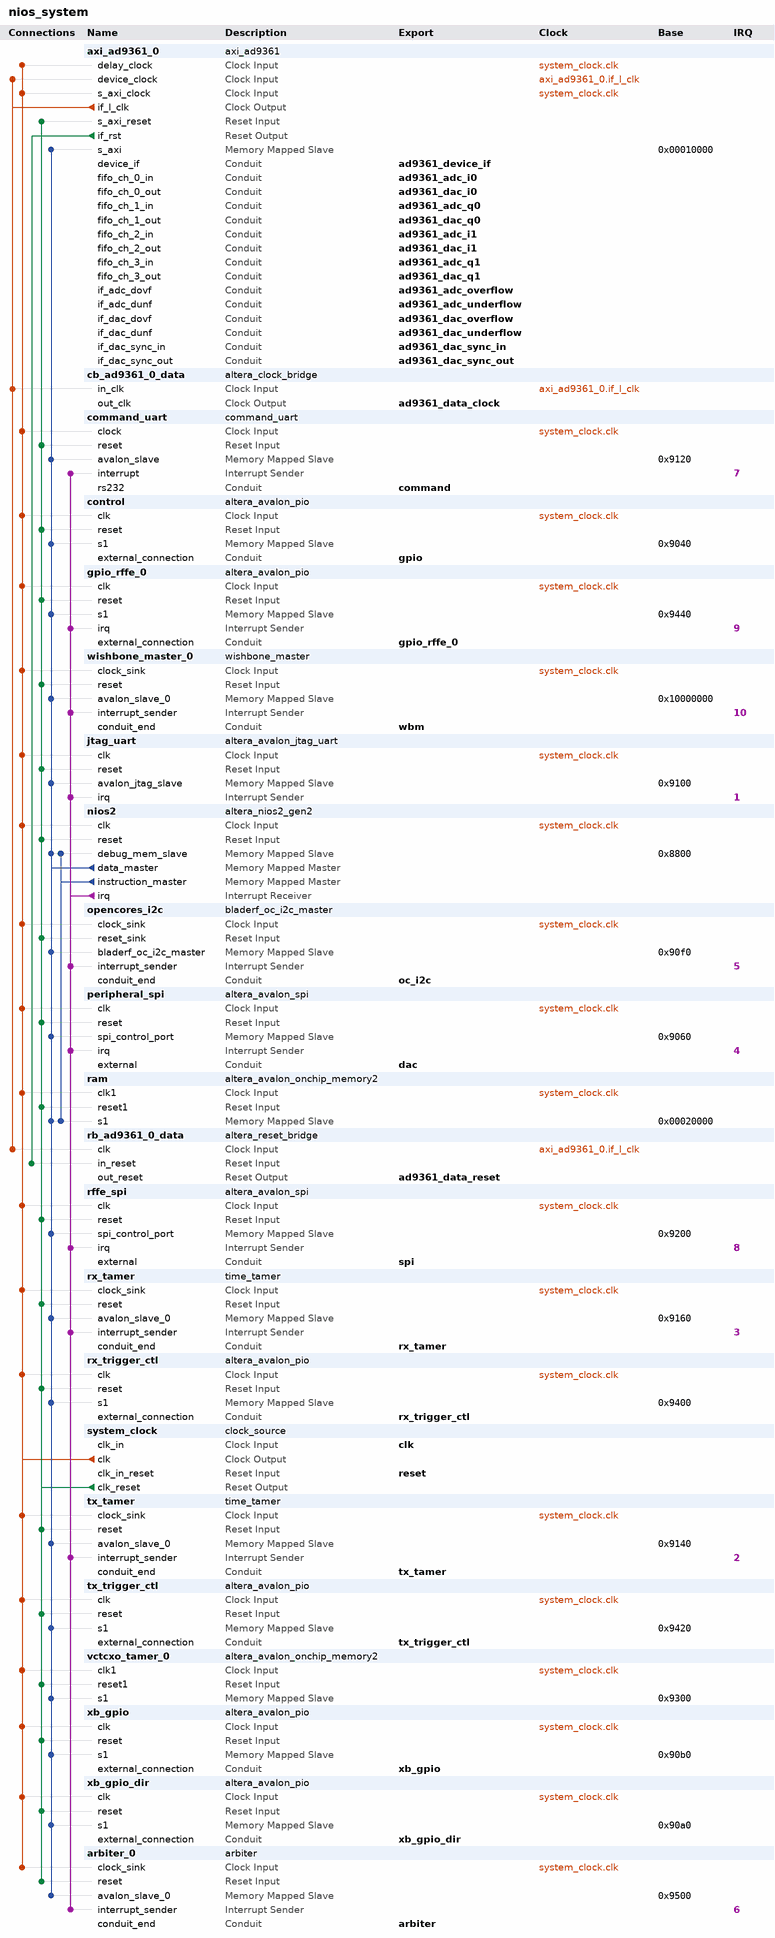
[diagram p0: system contents]
# Platform Designer (Qsys) system nios_system, Cyclone V 5CEBA9F23C8
# Parameters at their usual value, and those the tool derives, are not listed.
package require -exact qsys 17.1
create_system nios_system
set_project_property DEVICE_FAMILY {Cyclone V}
set_project_property DEVICE 5CEBA9F23C8

add_instance axi_ad9361_0 axi_ad9361 1.0
set_instance_parameter_value axi_ad9361_0 DAC_DDS_DISABLE 1
set_instance_parameter_value axi_ad9361_0 DEVICE_TYPE 0
set_instance_parameter_value axi_ad9361_0 ID 0

add_instance cb_ad9361_0_data altera_clock_bridge 17.1
set_instance_parameter_value cb_ad9361_0_data DERIVED_CLOCK_RATE 0
set_instance_parameter_value cb_ad9361_0_data EXPLICIT_CLOCK_RATE 0

add_instance command_uart command_uart 1.0

add_instance control altera_avalon_pio 17.1
set_instance_parameter_value control bitModifyingOutReg true
set_instance_parameter_value control direction InOut
set_instance_parameter_value control width 32

add_instance gpio_rffe_0 altera_avalon_pio 17.1
set_instance_parameter_value gpio_rffe_0 bitModifyingOutReg true
set_instance_parameter_value gpio_rffe_0 direction InOut
set_instance_parameter_value gpio_rffe_0 generateIRQ true
set_instance_parameter_value gpio_rffe_0 resetValue 98304
set_instance_parameter_value gpio_rffe_0 width 32

add_instance wishbone_master_0 wishbone_master 1.0
set_instance_parameter_value wishbone_master_0 ADDR_BITS 32
set_instance_parameter_value wishbone_master_0 DATA_BITS 32

add_instance jtag_uart altera_avalon_jtag_uart 17.1
set_instance_parameter_value jtag_uart simInteractiveOptions INTERACTIVE_INPUT_OUTPUT

add_instance nios2 altera_nios2_gen2 17.1
set_instance_parameter_value nios2 dcache_size 2048
set_instance_parameter_value nios2 dividerType srt2
set_instance_parameter_value nios2 exceptionSlave ram.s1
set_instance_parameter_value nios2 icache_size 2048
set_instance_parameter_value nios2 impl Tiny
set_instance_parameter_value nios2 mul_64_impl 1
set_instance_parameter_value nios2 mul_shift_choice 1
set_instance_parameter_value nios2 resetSlave ram.s1
set_instance_parameter_value nios2 setting_activateTrace true

add_instance opencores_i2c bladerf_oc_i2c_master 1.0
set_instance_parameter_value opencores_i2c ARST_LVL 1

add_instance peripheral_spi altera_avalon_spi 17.1
set_instance_parameter_value peripheral_spi clockPhase 1
set_instance_parameter_value peripheral_spi clockPolarity 1
set_instance_parameter_value peripheral_spi dataWidth 8
set_instance_parameter_value peripheral_spi masterSPI true
set_instance_parameter_value peripheral_spi numberOfSlaves 2
set_instance_parameter_value peripheral_spi targetClockRate 9600000

add_instance ram altera_avalon_onchip_memory2 17.1
set_instance_parameter_value ram allowInSystemMemoryContentEditor true
set_instance_parameter_value ram dataWidth 32
set_instance_parameter_value ram dualPort false
set_instance_parameter_value ram initMemContent true
set_instance_parameter_value ram initializationFileName onchip_memory2_0
set_instance_parameter_value ram instanceID MED
set_instance_parameter_value ram memorySize 131072

add_instance rb_ad9361_0_data altera_reset_bridge 17.1
set_instance_parameter_value rb_ad9361_0_data ACTIVE_LOW_RESET 0
set_instance_parameter_value rb_ad9361_0_data SYNCHRONOUS_EDGES deassert

add_instance rffe_spi altera_avalon_spi 17.1
set_instance_parameter_value rffe_spi clockPolarity 1
set_instance_parameter_value rffe_spi dataWidth 8
set_instance_parameter_value rffe_spi masterSPI true
set_instance_parameter_value rffe_spi numberOfSlaves 1
set_instance_parameter_value rffe_spi targetClockRate 40000000

add_instance rx_tamer time_tamer 1.0

add_instance rx_trigger_ctl altera_avalon_pio 17.1
set_instance_parameter_value rx_trigger_ctl bitModifyingOutReg true
set_instance_parameter_value rx_trigger_ctl direction InOut
set_instance_parameter_value rx_trigger_ctl width 8

add_instance system_clock clock_source 17.1
set_instance_parameter_value system_clock clockFrequency 80000000
set_instance_parameter_value system_clock resetSynchronousEdges DEASSERT

add_instance tx_tamer time_tamer 1.0

add_instance tx_trigger_ctl altera_avalon_pio 17.1
set_instance_parameter_value tx_trigger_ctl bitModifyingOutReg true
set_instance_parameter_value tx_trigger_ctl direction InOut
set_instance_parameter_value tx_trigger_ctl width 8

add_instance vctcxo_tamer_0 altera_avalon_onchip_memory2 17.1
set_instance_parameter_value vctcxo_tamer_0 dataWidth 8
set_instance_parameter_value vctcxo_tamer_0 dualPort false
set_instance_parameter_value vctcxo_tamer_0 initMemContent false
set_instance_parameter_value vctcxo_tamer_0 initializationFileName onchip_mem.hex
set_instance_parameter_value vctcxo_tamer_0 memorySize 256

add_instance xb_gpio altera_avalon_pio 17.1
set_instance_parameter_value xb_gpio direction InOut
set_instance_parameter_value xb_gpio width 32

add_instance xb_gpio_dir altera_avalon_pio 17.1
set_instance_parameter_value xb_gpio_dir direction Output
set_instance_parameter_value xb_gpio_dir width 32

add_instance arbiter_0 arbiter 1.0
set_instance_parameter_value arbiter_0 N 2

# connections
add_connection axi_ad9361_0.if_l_clk axi_ad9361_0.device_clock clock
add_connection axi_ad9361_0.if_l_clk cb_ad9361_0_data.in_clk clock
add_connection axi_ad9361_0.if_l_clk rb_ad9361_0_data.clk clock
add_connection system_clock.clk arbiter_0.clock_sink clock
add_connection system_clock.clk axi_ad9361_0.delay_clock clock
add_connection system_clock.clk axi_ad9361_0.s_axi_clock clock
add_connection system_clock.clk command_uart.clock clock
add_connection system_clock.clk control.clk clock
add_connection system_clock.clk gpio_rffe_0.clk clock
add_connection system_clock.clk jtag_uart.clk clock
add_connection system_clock.clk nios2.clk clock
add_connection system_clock.clk opencores_i2c.clock_sink clock
add_connection system_clock.clk peripheral_spi.clk clock
add_connection system_clock.clk ram.clk1 clock
add_connection system_clock.clk rffe_spi.clk clock
add_connection system_clock.clk rx_tamer.clock_sink clock
add_connection system_clock.clk rx_trigger_ctl.clk clock
add_connection system_clock.clk tx_tamer.clock_sink clock
add_connection system_clock.clk tx_trigger_ctl.clk clock
add_connection system_clock.clk vctcxo_tamer_0.clk1 clock
add_connection system_clock.clk wishbone_master_0.clock_sink clock
add_connection system_clock.clk xb_gpio.clk clock
add_connection system_clock.clk xb_gpio_dir.clk clock
add_connection axi_ad9361_0.if_rst rb_ad9361_0_data.in_reset reset
add_connection system_clock.clk_reset arbiter_0.reset reset
add_connection system_clock.clk_reset axi_ad9361_0.s_axi_reset reset
add_connection system_clock.clk_reset command_uart.reset reset
add_connection system_clock.clk_reset control.reset reset
add_connection system_clock.clk_reset gpio_rffe_0.reset reset
add_connection system_clock.clk_reset jtag_uart.reset reset
add_connection system_clock.clk_reset nios2.reset reset
add_connection system_clock.clk_reset opencores_i2c.reset_sink reset
add_connection system_clock.clk_reset peripheral_spi.reset reset
add_connection system_clock.clk_reset ram.reset1 reset
add_connection system_clock.clk_reset rffe_spi.reset reset
add_connection system_clock.clk_reset rx_tamer.reset reset
add_connection system_clock.clk_reset rx_trigger_ctl.reset reset
add_connection system_clock.clk_reset tx_tamer.reset reset
add_connection system_clock.clk_reset tx_trigger_ctl.reset reset
add_connection system_clock.clk_reset vctcxo_tamer_0.reset1 reset
add_connection system_clock.clk_reset wishbone_master_0.reset reset
add_connection system_clock.clk_reset xb_gpio.reset reset
add_connection system_clock.clk_reset xb_gpio_dir.reset reset
add_connection nios2.data_master arbiter_0.avalon_slave_0 avalon
set_connection_parameter_value nios2.data_master/arbiter_0.avalon_slave_0 baseAddress 0x9500
add_connection nios2.data_master axi_ad9361_0.s_axi avalon
set_connection_parameter_value nios2.data_master/axi_ad9361_0.s_axi baseAddress 0x00010000
add_connection nios2.data_master command_uart.avalon_slave avalon
set_connection_parameter_value nios2.data_master/command_uart.avalon_slave baseAddress 0x9120
add_connection nios2.data_master control.s1 avalon
set_connection_parameter_value nios2.data_master/control.s1 baseAddress 0x9040
add_connection nios2.data_master gpio_rffe_0.s1 avalon
set_connection_parameter_value nios2.data_master/gpio_rffe_0.s1 baseAddress 0x9440
add_connection nios2.data_master jtag_uart.avalon_jtag_slave avalon
set_connection_parameter_value nios2.data_master/jtag_uart.avalon_jtag_slave baseAddress 0x9100
add_connection nios2.data_master nios2.debug_mem_slave avalon
set_connection_parameter_value nios2.data_master/nios2.debug_mem_slave baseAddress 0x8800
add_connection nios2.data_master opencores_i2c.bladerf_oc_i2c_master avalon
set_connection_parameter_value nios2.data_master/opencores_i2c.bladerf_oc_i2c_master baseAddress 0x90f0
add_connection nios2.data_master peripheral_spi.spi_control_port avalon
set_connection_parameter_value nios2.data_master/peripheral_spi.spi_control_port baseAddress 0x9060
add_connection nios2.data_master ram.s1 avalon
set_connection_parameter_value nios2.data_master/ram.s1 baseAddress 0x00020000
add_connection nios2.data_master rffe_spi.spi_control_port avalon
set_connection_parameter_value nios2.data_master/rffe_spi.spi_control_port baseAddress 0x9200
add_connection nios2.data_master rx_tamer.avalon_slave_0 avalon
set_connection_parameter_value nios2.data_master/rx_tamer.avalon_slave_0 baseAddress 0x9160
add_connection nios2.data_master rx_trigger_ctl.s1 avalon
set_connection_parameter_value nios2.data_master/rx_trigger_ctl.s1 baseAddress 0x9400
add_connection nios2.data_master tx_tamer.avalon_slave_0 avalon
set_connection_parameter_value nios2.data_master/tx_tamer.avalon_slave_0 baseAddress 0x9140
add_connection nios2.data_master tx_trigger_ctl.s1 avalon
set_connection_parameter_value nios2.data_master/tx_trigger_ctl.s1 baseAddress 0x9420
add_connection nios2.data_master vctcxo_tamer_0.s1 avalon
set_connection_parameter_value nios2.data_master/vctcxo_tamer_0.s1 baseAddress 0x9300
add_connection nios2.data_master wishbone_master_0.avalon_slave_0 avalon
set_connection_parameter_value nios2.data_master/wishbone_master_0.avalon_slave_0 baseAddress 0x10000000
add_connection nios2.data_master xb_gpio.s1 avalon
set_connection_parameter_value nios2.data_master/xb_gpio.s1 baseAddress 0x90b0
add_connection nios2.data_master xb_gpio_dir.s1 avalon
set_connection_parameter_value nios2.data_master/xb_gpio_dir.s1 baseAddress 0x90a0
add_connection nios2.instruction_master nios2.debug_mem_slave avalon
set_connection_parameter_value nios2.instruction_master/nios2.debug_mem_slave baseAddress 0x8800
add_connection nios2.instruction_master ram.s1 avalon
set_connection_parameter_value nios2.instruction_master/ram.s1 baseAddress 0x00020000
add_connection nios2.irq arbiter_0.interrupt_sender interrupt
set_connection_parameter_value nios2.irq/arbiter_0.interrupt_sender irqNumber 6
add_connection nios2.irq command_uart.interrupt interrupt
set_connection_parameter_value nios2.irq/command_uart.interrupt irqNumber 7
add_connection nios2.irq gpio_rffe_0.irq interrupt
set_connection_parameter_value nios2.irq/gpio_rffe_0.irq irqNumber 9
add_connection nios2.irq jtag_uart.irq interrupt
set_connection_parameter_value nios2.irq/jtag_uart.irq irqNumber 1
add_connection nios2.irq opencores_i2c.interrupt_sender interrupt
set_connection_parameter_value nios2.irq/opencores_i2c.interrupt_sender irqNumber 5
add_connection nios2.irq peripheral_spi.irq interrupt
set_connection_parameter_value nios2.irq/peripheral_spi.irq irqNumber 4
add_connection nios2.irq rffe_spi.irq interrupt
set_connection_parameter_value nios2.irq/rffe_spi.irq irqNumber 8
add_connection nios2.irq rx_tamer.interrupt_sender interrupt
set_connection_parameter_value nios2.irq/rx_tamer.interrupt_sender irqNumber 3
add_connection nios2.irq tx_tamer.interrupt_sender interrupt
set_connection_parameter_value nios2.irq/tx_tamer.interrupt_sender irqNumber 2
add_connection nios2.irq wishbone_master_0.interrupt_sender interrupt
set_connection_parameter_value nios2.irq/wishbone_master_0.interrupt_sender irqNumber 10

# exported interfaces
add_interface ad9361_adc_i0 conduit end
set_interface_property ad9361_adc_i0 EXPORT_OF axi_ad9361_0.fifo_ch_0_in
add_interface ad9361_adc_i1 conduit end
set_interface_property ad9361_adc_i1 EXPORT_OF axi_ad9361_0.fifo_ch_2_in
add_interface ad9361_adc_overflow conduit end
set_interface_property ad9361_adc_overflow EXPORT_OF axi_ad9361_0.if_adc_dovf
add_interface ad9361_adc_q0 conduit end
set_interface_property ad9361_adc_q0 EXPORT_OF axi_ad9361_0.fifo_ch_1_in
add_interface ad9361_adc_q1 conduit end
set_interface_property ad9361_adc_q1 EXPORT_OF axi_ad9361_0.fifo_ch_3_in
add_interface ad9361_adc_underflow conduit end
set_interface_property ad9361_adc_underflow EXPORT_OF axi_ad9361_0.if_adc_dunf
add_interface ad9361_dac_i0 conduit end
set_interface_property ad9361_dac_i0 EXPORT_OF axi_ad9361_0.fifo_ch_0_out
add_interface ad9361_dac_i1 conduit end
set_interface_property ad9361_dac_i1 EXPORT_OF axi_ad9361_0.fifo_ch_2_out
add_interface ad9361_dac_overflow conduit end
set_interface_property ad9361_dac_overflow EXPORT_OF axi_ad9361_0.if_dac_dovf
add_interface ad9361_dac_q0 conduit end
set_interface_property ad9361_dac_q0 EXPORT_OF axi_ad9361_0.fifo_ch_1_out
add_interface ad9361_dac_q1 conduit end
set_interface_property ad9361_dac_q1 EXPORT_OF axi_ad9361_0.fifo_ch_3_out
add_interface ad9361_dac_sync_in conduit end
set_interface_property ad9361_dac_sync_in EXPORT_OF axi_ad9361_0.if_dac_sync_in
add_interface ad9361_dac_sync_out conduit end
set_interface_property ad9361_dac_sync_out EXPORT_OF axi_ad9361_0.if_dac_sync_out
add_interface ad9361_dac_underflow conduit end
set_interface_property ad9361_dac_underflow EXPORT_OF axi_ad9361_0.if_dac_dunf
add_interface ad9361_data_clock clock source
set_interface_property ad9361_data_clock EXPORT_OF cb_ad9361_0_data.out_clk
add_interface ad9361_data_reset reset source
set_interface_property ad9361_data_reset EXPORT_OF rb_ad9361_0_data.out_reset
add_interface ad9361_device_if conduit end
set_interface_property ad9361_device_if EXPORT_OF axi_ad9361_0.device_if
add_interface arbiter conduit end
set_interface_property arbiter EXPORT_OF arbiter_0.conduit_end
add_interface clk clock sink
set_interface_property clk EXPORT_OF system_clock.clk_in
add_interface command conduit end
set_interface_property command EXPORT_OF command_uart.rs232
add_interface dac conduit end
set_interface_property dac EXPORT_OF peripheral_spi.external
add_interface gpio conduit end
set_interface_property gpio EXPORT_OF control.external_connection
add_interface gpio_rffe_0 conduit end
set_interface_property gpio_rffe_0 EXPORT_OF gpio_rffe_0.external_connection
add_interface oc_i2c conduit end
set_interface_property oc_i2c EXPORT_OF opencores_i2c.conduit_end
add_interface reset reset sink
set_interface_property reset EXPORT_OF system_clock.clk_in_reset
add_interface rx_tamer conduit end
set_interface_property rx_tamer EXPORT_OF rx_tamer.conduit_end
add_interface rx_trigger_ctl conduit end
set_interface_property rx_trigger_ctl EXPORT_OF rx_trigger_ctl.external_connection
add_interface spi conduit end
set_interface_property spi EXPORT_OF rffe_spi.external
add_interface tx_tamer conduit end
set_interface_property tx_tamer EXPORT_OF tx_tamer.conduit_end
add_interface tx_trigger_ctl conduit end
set_interface_property tx_trigger_ctl EXPORT_OF tx_trigger_ctl.external_connection
add_interface wbm conduit end
set_interface_property wbm EXPORT_OF wishbone_master_0.conduit_end
add_interface xb_gpio conduit end
set_interface_property xb_gpio EXPORT_OF xb_gpio.external_connection
add_interface xb_gpio_dir conduit end
set_interface_property xb_gpio_dir EXPORT_OF xb_gpio_dir.external_connection

set_interconnect_requirement {$system} qsys_mm.clockCrossingAdapter HANDSHAKE
set_interconnect_requirement {$system} qsys_mm.enableEccProtection FALSE
set_interconnect_requirement {$system} qsys_mm.insertDefaultSlave FALSE
set_interconnect_requirement {$system} qsys_mm.maxAdditionalLatency 1

save_system nios_system.qsys
